# Altium schematic sheet EnDat-Biss.SchDoc
size A4
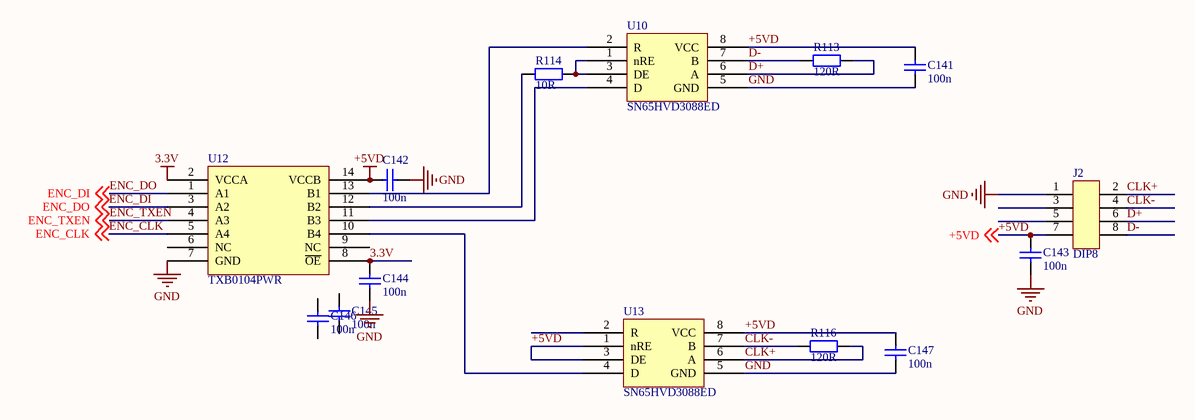
[diagram p0: EnDat-Biss.SchDoc]

## Parts
C141  100n  [0603C]
C142  100n  [0603C]
C143  100n  [0603C]
C144  100n  [0603C]
C145  100n  [0603C]
C146  100n  [0603C]
C147  100n  [0603C]
J2  DIP8  [DIP8-2.54]
R113  120R  [0603R]
R114  10R  [0603R]
R116  120R  [0603R]
U10  SN65HVD3088ED  [SOIC-8]
U12  TXB0104PWR  [TSSOP-14]
U13  SN65HVD3088ED  [SOIC-8]

## Nets
3.3V: C144.1 U12.2(VCCA) U12.8(~{OE})
+5VD: C141.2 C142.2 C143.1 C147.2 J2.7 U10.8(VCC) U12.14(VCCB) U13.1(nRE) U13.3(DE) U13.8(VCC) ; off-sheet +5VD
GND: C141.1 C142.1 C143.2 C144.2 C147.1 J2.1 U10.5(GND) U12.7(GND) U13.5(GND)
CLK+: J2.2 R116.1 U13.6(A)
CLK-: J2.4 R116.2 U13.7(B)
D+: J2.6 R113.1 U10.6(A)
D-: J2.8 R113.2 U10.7(B)
ENC_CLK: U12.5(A4) ; off-sheet ENC_CLK
ENC_DI: U12.1(A1) U12.3(A2) ; off-sheet ENC_DO, off-sheet ENC_DI  [also labelled ENC_DO]
ENC_TXEN: U12.4(A3) ; off-sheet ENC_TXEN
NetR114_1: R114.1 U10.1(nRE) U10.3(DE)
NetR114_2: R114.2 U12.12(B2)
NetU10_2: U10.2(R) U12.13(B1)
NetU10_4: U10.4(D) U12.11(B3)
NetU12_10: U12.10(B4) U13.4(D)

Not connected (* = marked no-connect by the designer): C145 1 2; C146 1 2; J2 3 5; U12 6(NC) 9(NC); U13 2(R)

## Library data of the parts
C141-C147 = Cap: Capacitor; Value: 100pF; Published: 8-Jun-2000; LatestRevisionDate: 17-Jul-2002; LatestRevisionNote: Re-released for DXP Platform.; PackageReference: RAD-0.3; Publisher: Altium Limited
J2 = DIP8: Connectors; Set Position: 0.5; Published: 8-Jun-2000; LatestRevisionDate: 17-Jul-2002; LatestRevisionNote: Re-released for DXP Platform.; PackageReference: AXIAL-0.6; Publisher: Altium Limited
R113 R114 R116 = Res2: Resistor; Value: 1K; Published: 8-Jun-2000; LatestRevisionDate: 17-Jul-2002; LatestRevisionNote: Re-released for DXP Platform.; PackageReference: AXIAL-0.4; Publisher: Altium Limited
U10 U13 = SN65HVD3088
U12 = TXB0104